# Altium schematic sheet CDRon_brushless.SchDoc
size A4
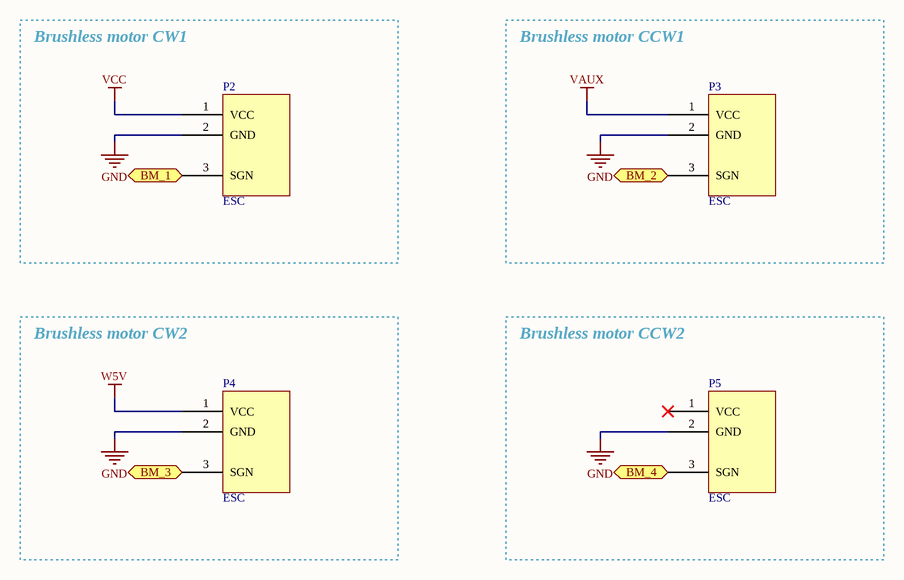
[diagram p0: CDRon_brushless.SchDoc]

## Parts
P2  ESC  [ESC]
P3  ESC  [ESC]
P4  ESC  [ESC]
P5  ESC  [ESC]

## Blocks framed on the sheet
Brushless motor CW1: P2
Brushless motor CCW1: P3
Brushless motor CW2: P4
Brushless motor CCW2: P5

## Ports
BM_1 (in), BM_2 (in), BM_3 (in), BM_4 (in)

## Nets
GND: P2.2(GND) P3.2(GND) P4.2(GND) P5.2(GND)
VAUX: P3.1(VCC)
VCC: P2.1(VCC)
W5V: P4.1(VCC)
BM_1: P2.3(SGN) ; port BM_1
BM_2: P3.3(SGN) ; port BM_2
BM_3: P4.3(SGN) ; port BM_3
BM_4: P5.3(SGN) ; port BM_4

Not connected (* = marked no-connect by the designer): P5 1(VCC)*